# Altium schematic sheet LP3985-3.3-150mA_电源.SchDoc
size A4; DocumentNumber: 16; SheetNumber: 16; SheetTotal: 30
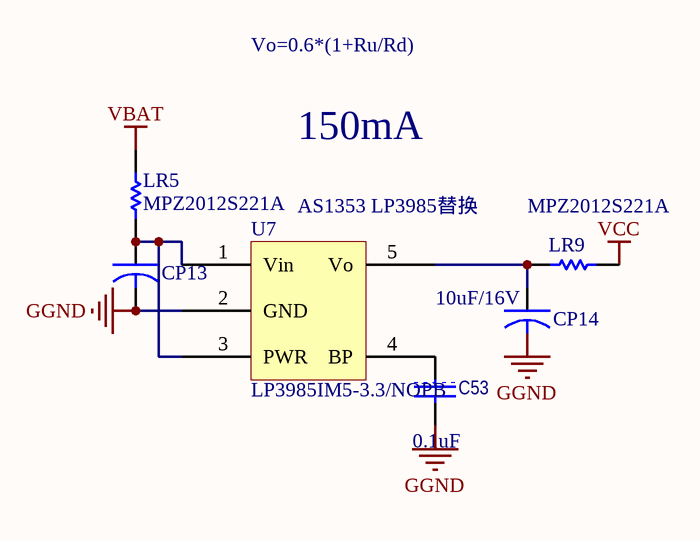
[diagram p0: LP3985-3.3-150mA_电源.SchDoc]

## Parts
C53  value 0.1uF  [1608[0603]C]  (hidden comment: C1608X7R1H104K)
CP13  TAJA106K016RNJ  [3216[1206]CB]  (value not drawn)
CP14  value 10uF/16V  [3216[1206]CB]  (hidden comment: TAJA106K016RNJ)
LR5  MPZ2012S221A  [2012[0805]]
LR9  MPZ2012S221A  [2012[0805]]
U7  LP3985IM5-3.3/NOPB  [SOT23-5BN]

## Nets
GGND: C53.2 CP13.2 U7.2(GND)
VBAT: LR5.2
VCC: LR9.1
NetC53_1: C53.1 U7.4(BP)
NetCP13_1: CP13.1 LR5.1 U7.1(Vin) U7.3(PWR)
NetCP14_1: CP14.1 LR9.2 U7.5(Vo)

Not connected (* = marked no-connect by the designer): CP14 2

## Notes on the sheet
- Vo=0.6*(1+Ru/Rd)
- 150mA
- (near U7) AS1353 LP3985替换
- Labels drawn without touching a wire or pin: GGND

## Library data of the parts
C53 = CAP: 多层陶瓷电容器MLCC - SMD/SMT 0603 0.1uF 50volts X7R 10%; Manufacturer: TDK; 产品: General Type MLCCs; 产品种类: Low & Medium Capacitance SMD Ceramic Chip Capacitors; 外壳代码 - in: 0603; 外壳代码 - mm: 1608; 封装 / 箱体: 0603 (1608 metric); 封装: Reel; 尺寸: 0.8 mm W x 1.6 mm L x 0.8 mm H; 工作温度范围: - 55 C to + 125 C; 标准包装数量: 4000; 电压额定值: 50 V; 电容-nF: 100 nF; 电容-pF: 100000 pF; 系列: C; Category: 多层陶瓷电容器MLCC - SMD/SMT; ComponentLink1Description: http://www.tdk.com/pdf/general_B11.pdf; ComponentLink1URL: http://www.tdk.com/pdf/general_B11.pdf; Description 1: 多层陶瓷电容器MLCC - SMD/SMT 0603 0.1uF 50volts X7R 10%; Manufacturer Part Number: C1608X7R1H104K; Minimum Order Quantity: 1; Pricing 1: 1=0.160, 50=0.070, 100=0.036, 500=0.019, 1000=0.013, 4000=0.010, 8000=0.009, 12000=0.008, 20000=0.007 (USD); Reeling: True; RoHS - 贸泽: Y; RoHS: RoHS Compliant; Stock 1: 224604; Supplier 1: Mouser; Supplier Part Number 1: 810-C1608X7R1H104K; 制造商: TDK; 容差: 10 %; 温度系数/代码: X7R; 电容: 0.1 uF; 端接类型: SMD/SMT
CP13 CP14 = CAPACITOR: 钽质电容器-固体SMD 16volts 10uF 10%; Manufacturer: AVX; ESR: 3 Ohms; 产品: Tantalum Solid Standard Grade - Other Various; 产品种类: SMD Tantalum Capacitors; 制造商库存号: A Case; 外壳代码 - in: 1206; 外壳代码 - mm: 3216; 封装 / 箱体: 1206 (3216 metric); 封装: Reel; 尺寸: 1.6 mm W x 3.2 mm L; 工作温度范围: - 55 C to + 125 C; 损耗因数 DF: 8; 标准包装数量: 2000; 漏泄电流: 1.6 uA; 电压额定值: 16 V; 端接类型: SMD/SMT; 系列: TAJ; 高度: 1.8 mm; Category: 钽质电容器-固体SMD; ComponentLink1Description: http://www.avx.com/docs/Catalogs/taj.pdf; ComponentLink1URL: http://www.avx.com/docs/Catalogs/taj.pdf; Description 1: 钽质电容器-固体SMD 16volts 10uF 10%; Manufacturer Part Number: TAJA106K016RNJ; Minimum Order Quantity: 1; Pricing 1: 1=0.600, 100=0.280, 200=0.250, 500=0.221, 1000=0.200, 2000=0.140, 5000=0.131, 10000=0.124, 25000=0.103 (USD); Reeling: True; RoHS - 贸泽: Y; RoHS: RoHS Compliant; Stock 1: 20335; Supplier 1: Mouser; Supplier Part Number 1: 581-TAJA106K016R; 制造商: AVX; 容差: 10 %; 电容: 10 uF
LR5 LR9 = Res Semi: 电磁干扰滤波珠子、扼流圈和阵列 Ferrite Chip Beads; Manufacturer: TDK; 阻抗: 220 Ohms; 最大直流电流: 3 A; 最大直流电阻: 0.04 Ohms; 工作温度范围: - 55 C to + 125 C; 封装 / 箱体: 2012; 封装: Reel; 端接类型: SMD/SMT; 容差: 25 %; 产品种类: Ferrite Beads; 标准包装数量: 4000; Supplier 1: Mouser; Supplier Part Number 1: 810-MPZ2012S221A; Manufacturer Part Number: MPZ2012S221A; RoHS: RoHS Compliant; Description 1: 电磁干扰滤波珠子、扼流圈和阵列 Ferrite Chip Beads; Category: 电磁干扰滤波珠子、扼流圈和阵列; Stock 1: 26540; Pricing 1: 1=0.070, 50=0.060, 100=0.053, 500=0.040, 1000=0.035, 4000=0.031, 8000=0.029, 12000=0.025 (USD); 制造商: TDK; RoHS - 贸泽: Y; Minimum Order Quantity: 1; Reeling: True; ComponentLink1URL: http://www.mouser.com/ds/2/400/e9413_mpz-24582.pdf; ComponentLink1Description: http://www.mouser.com/ds/2/400/e9413_mpz-24582.pdf
U7 = LT1761: 低压差稳压器 - LDO 150Ma Low Noise CMOS LDO; Manufacturer: Texas Instruments; 最大输入电压: 6 V; 输出端数量: 1; 输出电流: 0.15 A; 输出类型: Fixed; 输出电压: 3.3 V; 封装 / 箱体: SOT-23; 封装: Reel; 回动电压（最大值）: 0.002 V at 1 mA, 0.035 V at 50 mA, 0.07 V at 100 mA, 0.1 V at 150 mA; 安装风格: SMD/SMT; 电压调节准确度: +/- 2 %; 最大工作温度: + 125 C; 最大功率耗散: 250 mW; 最小工作温度: - 40 C; 标准包装数量: 1000; Product Status: New at Mouser; Supplier 1: Mouser; Supplier Part Number 1: 926-3985IM5-3.3/NOPB; Manufacturer Part Number: LP3985IM5-3.3/NOPB; RoHS: RoHS Compliant; Description 1: 低压差稳压器 - LDO 150Ma Low Noise CMOS LDO; Category: 低压差稳压器 - LDO; Stock 1: 37442; Pricing 1: 1=0.400, 10=0.337, 25=0.300, 50=0.283, 100=0.202, 250=0.199, 500=0.195, 750=0.191, 1000=0.188 (USD); 制造商: Texas Instruments; RoHS - 贸泽: Y; Minimum Order Quantity: 1; Reeling: True; ComponentLink1URL: http://www.mouser.com/ds/2/282/snvs087ab-122675.pdf; ComponentLink1Description: http://www.mouser.com/ds/2/282/snvs087ab-122675.pdf